# Altium schematic sheet ESP8266.SchDoc
size A3
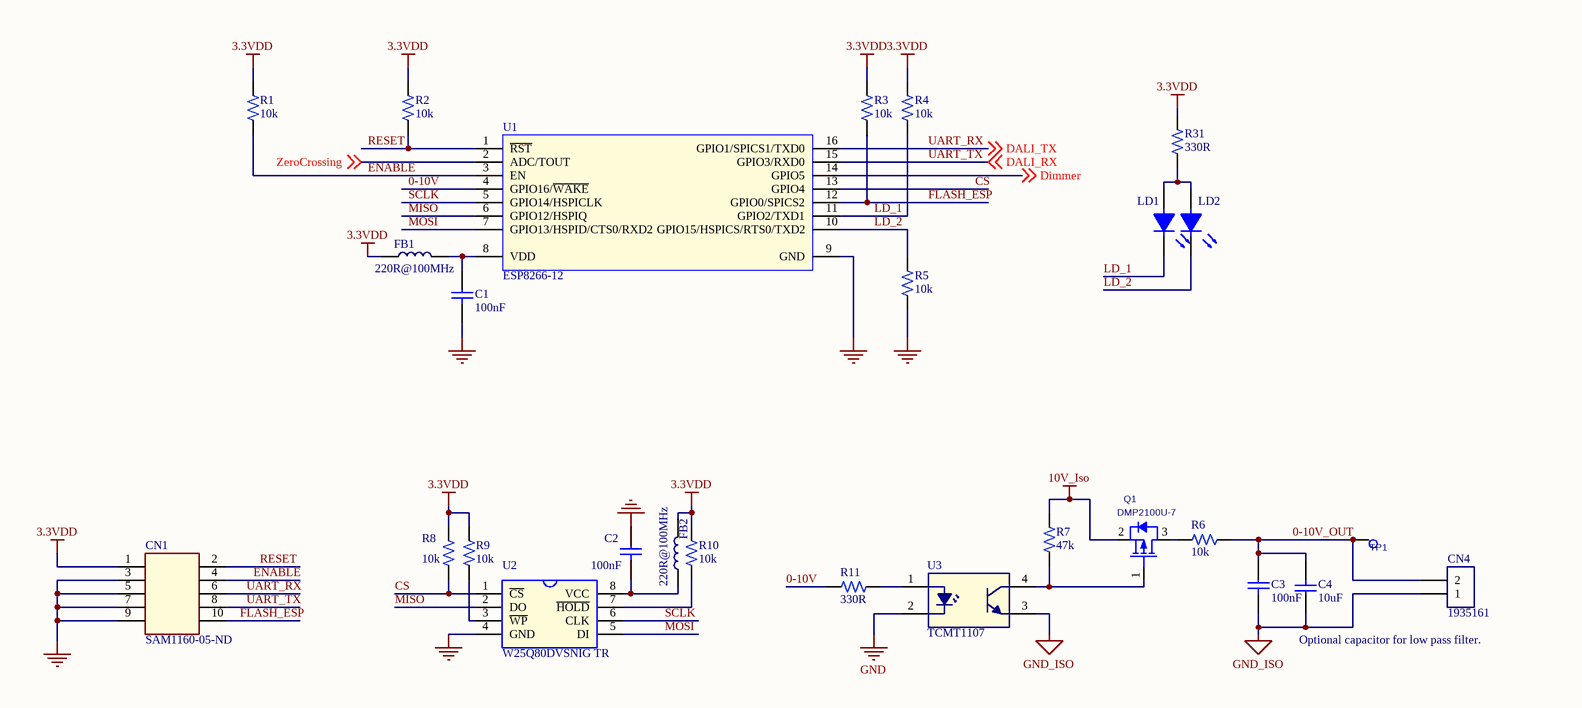
[diagram p0: ESP8266.SchDoc]

## Parts
C1  100nF  [0603-3D]
C2  100nF  [0603-3D]
C3  100nF  [0603-3D]
C4  10uF  [CAP-0603-3D]
CN1  SAM1160-05-ND  [CON-SMD-MINITEK-H-2X5-127P]
CN4  1935161  [TERM BLOCK PCB 2POS 5.0MM]
FB1  220R@100MHz  [IND-0603-3D]
FB2  220R@100MHz  [IND-0603-3D]
LD1  LG R971-KN-1  [GREEN-LED-0805-3D]  (value not drawn)
LD2  LS R976-NR-1  [RED-LED-0805-3D]  (value not drawn)
Q1  value DMP2100U-7  [SOT23-3D]  (hidden comment: MOSFET P CH 20V 4.3A SOT23)
R1  10k  [0603-3D]
R2  10k  [0603-3D]
R3  10k  [0603-3D]
R4  10k  [0603-3D]
R5  10k  [0603-3D]
R6  10k  [0603-3D]
R7  47k  [0603-3D]
R8  10k  [0603-3D]
R9  10k  [0603-3D]
R10  10k  [0603-3D]
R11  value 330R  [0603-3D]  (hidden comment: RES SMD 330 OHM 5% 1/10W 0603)
R31  value 330R  [0603-3D]  (hidden comment: RES SMD 330 OHM 5% 1/10W 0603)
TP1  MECH TESTPOINT 1mm  [Fiducial smd 1mm]  (value not drawn)  (no BOM)
U1  ESP8266-12  [ESP8266-14-3D]
U2  W25Q80DVSNIG TR  [SOIC8-3D]
U3  TCMT1107  [SOP4]

## Nets
3.3VDD: CN1.1 FB1.1 FB2.2 R1.2 R2.2 R3.2 R4.2 R8.2 R9.2 R10.2 R31.2
10V_Iso: Q1.2(S) R7.2
GND: C1.2 C2.1 CN1.3 CN1.5 CN1.7 CN1.9 R5.1 U1.9(GND) U2.4(GND) U3.2(K)
GND_ISO: C3.2 C4.1 CN4.1 U3.3(E)
0-10V: R11.1 U1.4(GPIO16/~{WAKE})
0-10V_OUT: C3.1 C4.2 CN4.2 R6.1 TP1.1
CS: R8.1 U1.13(GPIO4) U2.1(~{CS})
Dimmer: U1.14(GPIO5) ; off-sheet Dimmer
ENABLE: CN1.4 R1.1 U1.3(EN)
FLASH_ESP: CN1.10 R3.1 U1.12(GPIO0/SPICS2)
LD_1: LD1.2(CATODE) R4.1 U1.11(GPIO2/TXD1)
LD_2: LD2.2(CATODE) R5.2 U1.10(GPIO15/HSPICS/RTS0/TXD2)
MISO: U1.6(GPIO12/HSPIQ) U2.2(DO)
MOSI: U1.7(GPIO13/HSPID/CTS0/RXD2) U2.5(DI)
RESET: CN1.2 R2.1 U1.1(~{RST})
SCLK: U1.5(GPIO14/HSPICLK) U2.6(CLK)
UART_RX: CN1.6 U1.16(GPIO1/SPICS1/TXD0) ; off-sheet DALI_TX  [also labelled DALI_TX]
UART_TX: CN1.8 U1.15(GPIO3/RXD0) ; off-sheet DALI_RX  [also labelled DALI_RX]
ZeroCrossing: U1.2(ADC/TOUT) ; off-sheet ZeroCrossing
NetC1_1: C1.1 FB1.2 U1.8(VDD)
NetC2_2: C2.2 FB2.1 U2.8(VCC)
NetLD1_1: LD1.1(ANODE) LD2.1(ANODE) R31.1
NetQ1_1: Q1.1(G) R7.1 U3.4(C)
NetQ1_3: Q1.3(D) R6.2
NetR9_1: R9.1 U2.3(~{WP})
NetR10_1: R10.1 U2.7(~{HOLD})
NetR11_2: R11.2 U3.1(A)

## Notes on the sheet
- Optional capacitor for low pass filter.
- Title
- Modified Date:
- Project:
- Draw by:
- Current Date:
- Approved by:
- Sheet
- Revision:
- of
- Instituto Nacional de Telecomunicações
- Av. João de Camargo, 510
- Santa Rita do Sapucaí - MG
- 3754000
- INATEL
- Size:
- A3
- File:
- +55 35 3471-9200

## Library data of the parts
C1-C3 = 0.1uF 10% 0603 MLCC X7R 50V: CAP CER 0.1UF 50V 10% X7R 0603; User: Anderson Daniel Soares; Code: *; Creation Date: 2015/01/23; Version: V01; Supplier 1: Digi-Key; Supplier Part Number 1: 445-5666-6-ND; Supplier 2: Mouser; Supplier Part Number 2: 810-CGA3E2X7R1H104K; Supplier 3: Newark; Supplier Part Number 3: 04X3156; Size: 0603; Voltage: 50V; Value: 100nF
C4 = 10uF 20% 0603 MLCC X5R 16V: CAP CER 10UF 16V 20% X5R 0603; User: Mateus Elias; Code: *; Creation Date: 2014/10/07; Supplier 1: Digi-Key; Supplier 2: Mouser; Supplier 3: Newark; Supplier Part Number 1: 490-7201-1-ND; Supplier Part Number 2: 963-EMK107BBJ106MA-T; Supplier Part Number 3: 68X2787; Version: V01; Size: 0603; Value: 10uF; Voltage: 16V
CN1 = SAM1160-05-ND CN HDR 5X2 1.27mm 90°: 10 Positions Header, Unshrouded Connector 0.050" (1.27mm) Surface Mount, Right Angle Gold; User: Jean Pierre; Code: *; Creation Date: 2016/09/19; Size: 5X2 1.27mm SMD; Supplier 1: Digi-Key; Supplier Part Number 1: SAM1160-05-ND; Version: V01; Value: SAM1160-05-ND
CN4 = 1935161  TERM BLOCK PCB 2X1: TERM BLOCK PCB 2POS 5.0MM; User: Rodrigo Balbi; Code: *; Creation Date: 2015/11/30; Size: -; Version: V02; Supplier 1: Digikey; Supplier Part Number 1: 277-1667-ND; Supplier 2: Mouser; Supplier 3: Newarc; Supplier Part Number 2: 651-1935161; Supplier Part Number 3: 70R0063; Value: 1935161
FB1 FB2 = 220R@100MHz 0603 FB 0.05R 2A: FERRITE CHIP 0603 220 OHM; User: Jean Pierre; Current Rating: 2A; Code: *; Creation Date: 2015/05/05; Version: V01; Size: 0603; Supplier 1: Digi-Key; Supplier Part Number 1: 445-1565-1-ND; Value: 220R@100MHz
LD1 = LED GREEN DIFFUSED 0805 SMD: Green 570nm LED Indication - Discrete 2.2V 0805 (2012 Metric); User: Reis; Code: *; Creation Date: 2017/03/22; Version: V01; Size: 0805; Supplier 1: Digi-Key; Supplier Part Number 1: 475-1410-1-ND; Value: LG R971-KN-1
LD2 = LED RED DIFFUSED 0805 SMD: Red 633nm LED Indication - Discrete 2V 0805 (2012 Metric); User: Reis; Code: *; Creation Date: 2017/03/23; Version: V01; Size: 0805; Supplier 1: Digi-Key; Supplier Part Number 1: 475-1278-1-ND; Value: LS R976-NR-1
Q1 = DMP2100U-7 MOSFET P-CH: User: Reis; Code: *; Creation Date: 2017/05/08; Size: SOT-23; Version: V03; Supplier 1: Digi-Key; Supplier Part Number 1: DMP2100U-7CT-ND; Supplier 2: Mouser; Supplier 3: Newark; Supplier Part Number 2: 621-DMP2100U-7; Supplier Part Number 3: 82Y6587
R1-R6 R8-R10 = 10k 1% 0603 TNF 1/10W: RES SMD 10K OHM 1% 1/10W 0603; Manufacturer: Yageo; Manufacturer Part Number: RC0603FR-0710KL; User: Pedro Vilela; Code: *; Creation Date: 2018/09/28; Version: V03; Size: 0603; Supplier 1: Digi-Key; Supplier 2: Mouser; Supplier 3: Newark; Supplier Part Number 1: 311-10.0KHRCT-ND; Supplier Part Number 2: 603-RC0603FR-0710KL; Supplier Part Number 3: 68X3181; Tolerance: 1%; ComponentLink1Description: 311-10.0KHRCT-ND; ComponentLink1URL: https://www.digikey.com/products/en?keywords=311-10.0KHRCT-ND; Value: 10k
R7 = 47k 1% 0603 TKF 1/16W: RES SMD 47K OHM 1% 1/10W 0603; User: Anderson Daniel Soares; Code: *; Creation Date: 2015/01/27; Supplier Link 1: http://www.digikey.com/product-search/en?pv7=2&k=311-47.0KHRCT-ND&mnonly=0&newproducts=0&ColumnSort=0&page=1&stock=1&quantity=0&ptm=0&fid=0&pageSize=25; Supplier Link 2: http://br.mouser.com/ProductDetail/Panasonic/ERJ-3EKF4702V/?qs=%2fha2pyFadujWqMGonbcVXdO432yyH%2fwnIoCZHha2gphIl1D2ssXdow%3d%3d; Supplier Link 3: http://www.newark.com/panasonic-electronic-components/erj-3ekf4702v/thick-film-resistor-47kohm-100mw/dp/64R5350?ost=64R5350; Version: V01; Supplier 1: Digi-Key; Supplier Part Number 1: 311-47.0KHRCT-ND; Supplier 2: Mouser; Supplier Part Number 2: 667-ERJ-3EKF4702V; Supplier 3: Newark; Supplier Part Number 3: 64R5350; Size: 0603; Value: 47k
R11 R31 = 330R 5% 0603 TKF 1/10W: User: Luiz F Siecola; Code: *; Creation Date: 2017/05/03; Version: V02; Size: 0603; Supplier 1: Digi-Key; Supplier Part Number 1: P330GCT-ND; Tolerance: 5%; Supplier 2: Mouser; Supplier 3: Newark; Supplier Part Number 2: 667-ERJ-3GEYJ331V; Supplier Part Number 3: 65T8629
TP1 = MECH TESTPOINT 1mm: Fiducial; User: Larissa; Code: *; Creation Date: 2015/09/10; Size: *; Supplier 1: N/A; Supplier Part Number 1: N/A; Version: V01
U1 = ESP8266-12 Wi-Fi Module: ESP8266 SMT MODULE; User: Ricardo Dias; Code: *; Creation Date: 2016/05/31; Size: LLC; Version: V01; Value: ESP8266-12
U2 = W25Q80DVSNIG TR IC FLASH 8MBIT: IC FLASH 8MBIT 104MHZ 8SOIC; User: Ricardo Dias; Code: *; Creation Date: 2016/06/07; Size: SOIC8; Version: V01; Supplier 1: Digi-Key; Supplier Part Number 1: W25Q80DVSNIG CT-ND; Value: W25Q80DVSNIG TR
U3 = TCMT1107 OPTO TRANS: OPTOISOLATOR 3.75KV TRANS 4-SOP; User: Jean Pierre; Code: *; Creation Date: 2017/06/23; Size: 4-SOP; Version: V01; Supplier 1: Digi-Key; Supplier 2: Mouser; Supplier 3: Newark; Value: TCMT1107; Supplier Part Number 1: TCMT1107CT-ND; Supplier Part Number 2: 782-TCMT1107; Supplier Part Number 3: 35C2113